# Altium schematic sheet 03_RSVD.SchDoc
size A3; DocumentNumber: 3; SheetNumber: 3; SheetTotal: 21
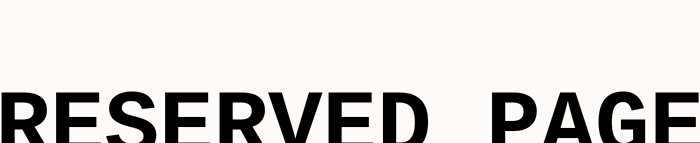
[diagram p0: 03_RSVD.SchDoc]

## Notes on the sheet
- RESERVED PAGE